# Altium schematic sheet current_sense_shunt.SchDoc
size A4; Author: Mikołaj Pichita; CompanyName: AGH University of Science and Technology; SheetNumber: 15; SheetTotal: 16
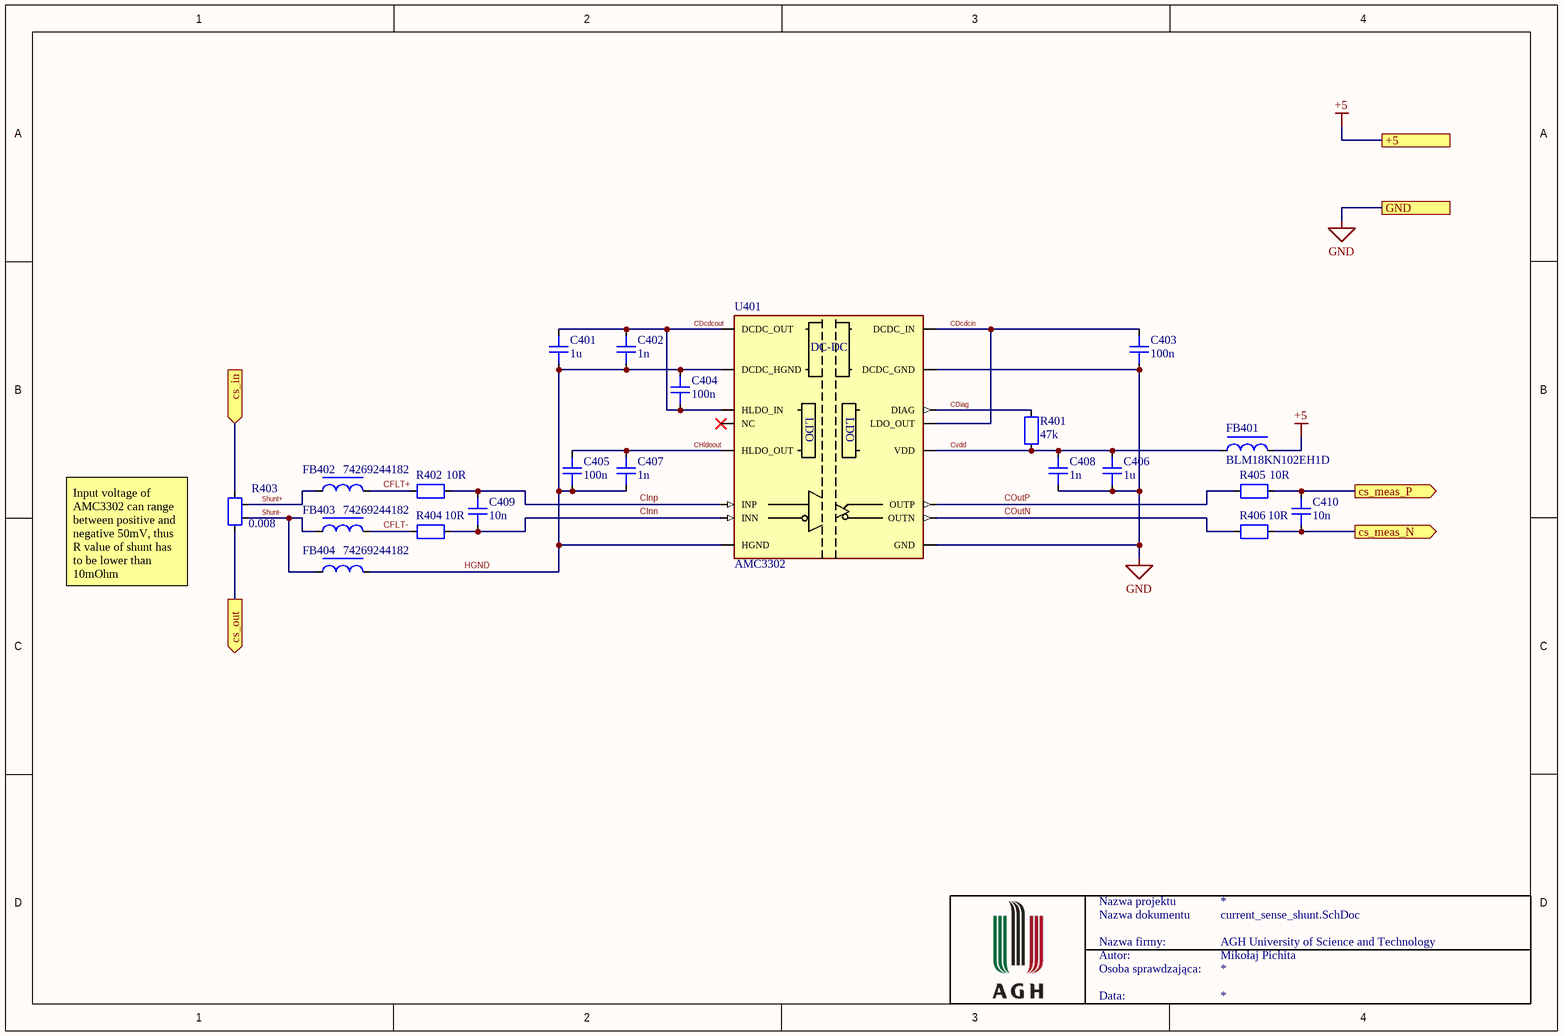
[diagram p0: current_sense_shunt.SchDoc]

## Parts
C401  1u  [CAP1206]
C402  1n  [CAP0603]
C403  100n  [CAP0603]
C404  100n  [CAP0603]
C405  100n  [CAP0603]
C406  1u  [CAP1206]
C407  1n  [CAP0603]
C408  1n  [CAP1206]
C409  10n  [CAP0603]
C410  10n  [CAP0603]
FB401  BLM18KN102EH1D  [RES0603]
FB402  74269244182  [FB0402]
FB403  74269244182  [FB0402]
FB404  74269244182  [FB0402]
R401  47k  [RES0603]
R402  10R  [RES0603]
R403  0.008  [WSL3637]
R404  10R  [RES0603]
R405  10R  [RES0603]
R406  10R  [RES0603]
U401  AMC3302  [SOIC127P1030X265-16N]

## Ports
+5 (see measurements[3C], choke_current_meas[4B], full_bridge[1C], isolator[1B], measurements[1C], microcontroller[1C], power_supply[2B], voltage_sense[4A]), cs_in (in, see measurements[3B]), cs_meas_N (out, see measurements[3C], measurements[3D]), cs_meas_P (out, see measurements[3C], measurements[3D]), cs_out (out, see measurements[3B]), GND (see measurements[3C], choke_current_meas[4B], full_bridge[1D], isolator[1B], measurements[1C], microcontroller[1C], power_supply[1B], voltage_sense[4B])

## Nets
+5: FB401.1 ; port +5
GND: C403.2 C406.2 C408.2 U401.9(GND) U401.15(DCDC_GND) ; port GND
CDcdcin: C403.1 U401.13(LDO_OUT) U401.16(DCDC_IN)
CDcdcout: C401.1 C402.1 C404.2 U401.1(DCDC_OUT) U401.3(HLDO_IN)
CDiag: R401.1 U401.14(DIAG)
CFLT+: FB402.2 R402.2
CFLT-: FB403.2 R404.2
CHldoout: C405.1 C407.1 U401.5(HLDO_OUT)
CInn: C409.1 R404.1 U401.7(INN)
CInp: C409.2 R402.1 U401.6(INP)
COutN: R406.2 U401.10(OUTN)
COutP: R405.2 U401.11(OUTP)
cs_in: R403.1 ; port cs_in
cs_meas_N: C410.1 R406.1 ; port cs_meas_N
cs_meas_P: C410.2 R405.1 ; port cs_meas_P
cs_out: R403.2 ; port cs_out
Cvdd: C406.1 C408.1 FB401.2 R401.2 U401.12(VDD)
HGND: C401.2 C402.2 C404.1 C405.2 C407.2 FB404.2 U401.2(DCDC_HGND) U401.8(HGND)
Shunt+: FB402.1 R403.4
Shunt-: FB403.1 FB404.1 R403.3

Not connected (* = marked no-connect by the designer): U401 4(NC)*

## Notes on the sheet
- (near R403) Input voltage of AMC3302 can range between positive and negative 50mV, thus R value of shunt has to be lower than 10mOhm
- Nazwa projektu
- Nazwa dokumentu
- Nazwa firmy:
- Autor:
- Osoba sprawdzająca:
- Data:
- (in symbol AMC3302) DC-DC; LDO

## Library data of the parts
C401-C410 = Capacitor: Value: *; HelpURL: *; MPN: *; Supplier: *; SupplierPartNumber: *; Supplier 1: Mouser
  C401 C406: Supplier Part Number 1: 581-12065C105K4Z4A
  C402 C407: Supplier Part Number 1: 581-0603YC102J4T2A
  C403-C405: Supplier Part Number 1: 581-06035C104KAT2A
  C408: Supplier Part Number 1: 581-1206GC102KAT3A
  C409 C410: Supplier Part Number 1: 581-06035C103K
FB401-FB404 = Ferrite Bead: Value: *; HelpURL: *; MPN: *; Supplier: *; SupplierPartNumber: *; Supplier 1: Mouser
  FB401: Supplier Part Number 1: 81-BLM18KN102EH1D
  FB402-FB404: Supplier Part Number 1: 710-74269244182
R401 R402 R404-R406 = Resistor: Value: *; HelpURL: *; MPN: *; Supplier: *; SupplierPartNumber: *; Supplier 1: Mouser
  R401: Supplier Part Number 1: 603-RP0603BRD0747KL
  R402 R404-R406: Supplier Part Number 1: 603-RP0603BRD0710RL
R403 = Shunt resistor: 0.008 Ohm Current Sense Resistor; Value: *; HelpURL: *; MPN: *; Supplier: *; SupplierPartNumber: *; Supplier 1: Mouser; Supplier Part Number 1: 71-WSL36378L000FEA
U401 = AMC3302: ±50-mV input, precision current sensing reinforced isolated amplifier with integrated DC/DC; Value: *; HelpURL: *; MPN: *; Supplier: *; SupplierPartNumber: *